# Altium schematic sheet Sheet1.SCHDOC
size 297 x 209 mm; SheetNumber: 1; SheetTotal: 1; DocumentName: Sheet1.SCHDOC
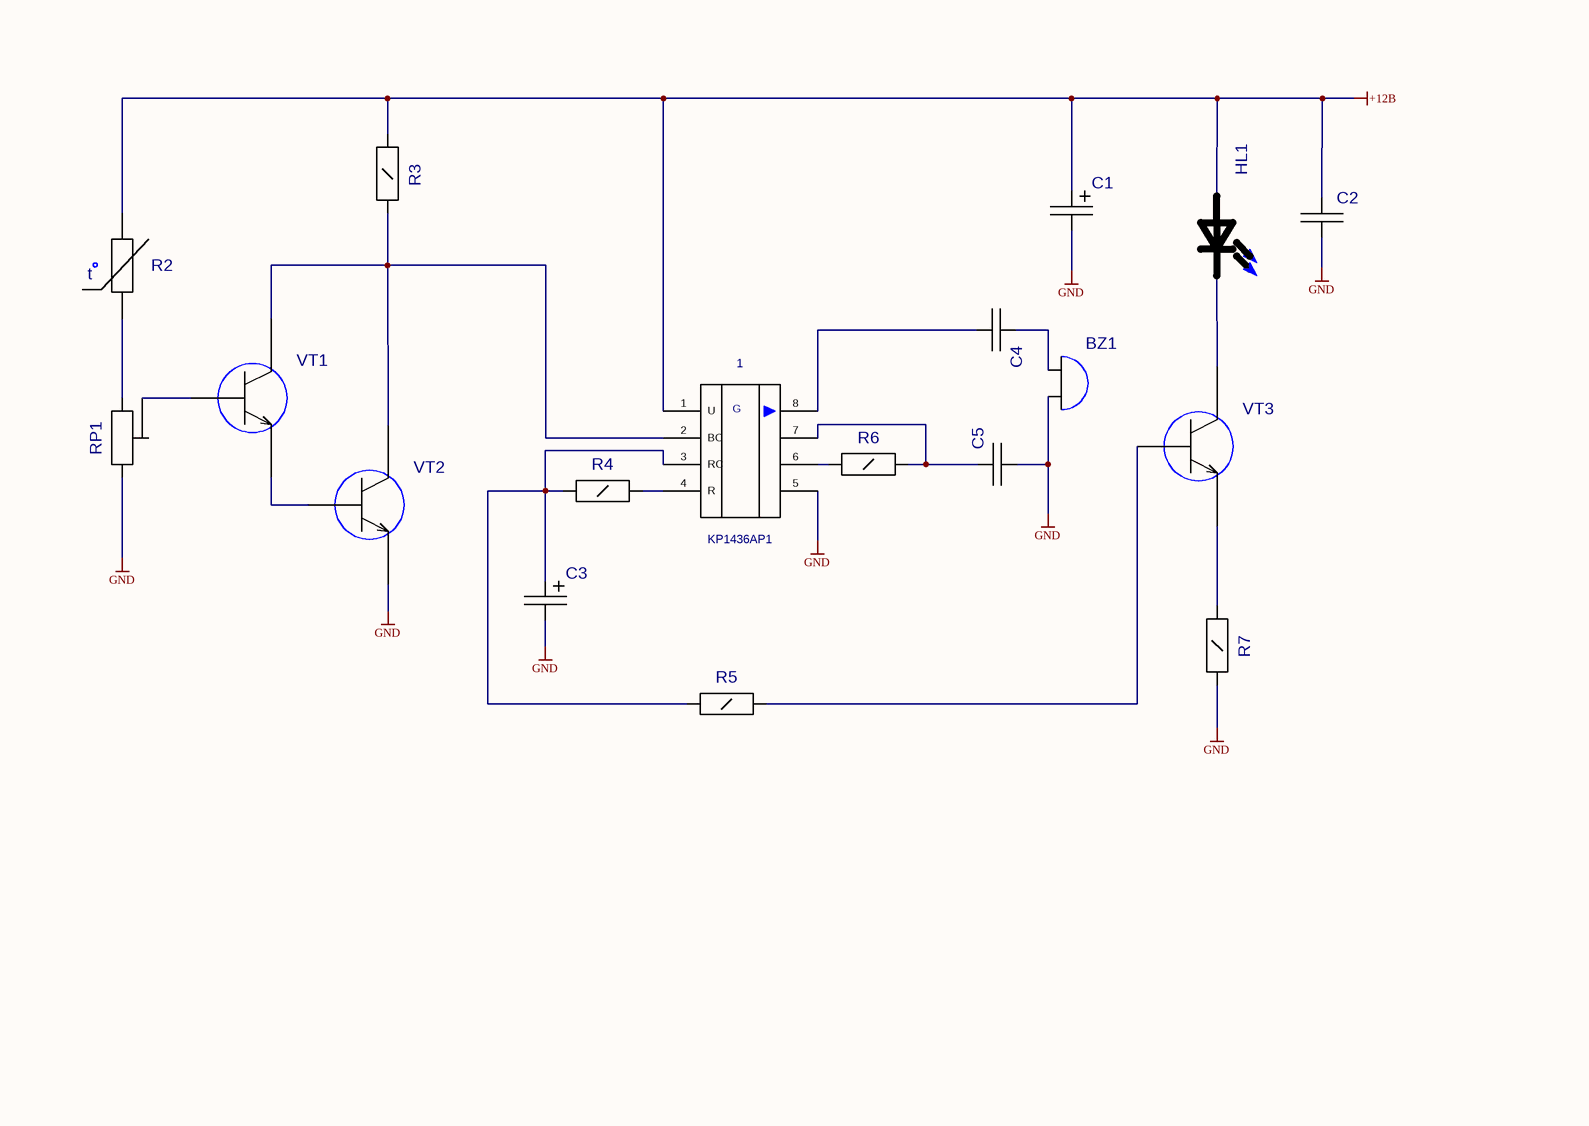
[diagram p0: Sheet1.SCHDOC]

## Parts
1  KP1436AP1  [KP1436AP1]
BZ1  ZUM1  [ZUM1]  (value not drawn)
C1  CE3528-B  [CE3528-B]  (value not drawn)
C2  CC0603  [CC0603]  (value not drawn)
C3  CE3528-B  [CE3528-B]  (value not drawn)
C4  CC0603  [CC0603]  (value not drawn)
C5  CC0603  [CC0603]  (value not drawn)
HL1  3528  [3528]  (value not drawn)
R2  B57861S0103F040  [B57861]  (value not drawn)
R3  C2-33H-0.25W_OLD_UGO  [C2-33H-0.25W]  (value not drawn)
R4  C2-33H-0.25W_OLD_UGO  [C2-33H-0.25W]  (value not drawn)
R5  C2-33H-0.25W_OLD_UGO  [C2-33H-0.25W]  (value not drawn)
R6  C2-33H-0.25W_OLD_UGO  [C2-33H-0.25W]  (value not drawn)
R7  C2-33H-0.25W_OLD_UGO  [C2-33H-0.25W]  (value not drawn)
RP1  3006W  [3006P]  (value not drawn)
VT1  2N4401  [TO-92-1]  (value not drawn)
VT2  2N4401  [TO-92-1]  (value not drawn)
VT3  2N4401  [TO-92-1]  (value not drawn)

## Nets
+12B: 1.1(U) C1.1(i/o) C2.2(i/o) HL1.A R2.2 R3.1
GND: 1.5 BZ1.2 C1.2(i/o1) C2.1(i/o1) C3.2(i/o1) C5.1(i/o1) R7.2 RP1.1 VT2.1(E)
Net1_2: 1.2(BC) R3.2 VT1.3(K) VT2.3(K)
Net1_3: 1.3(RC) C3.1(i/o) R4.1 R5.1
Net1_4: 1.4(R) R4.2
Net1_6: 1.6 R6.1
Net1_7: 1.7 C5.2(i/o) R6.2
Net1_8: 1.8 C4.1(i/o1)
NetBZ1_1: BZ1.1 C4.2(i/o)
NetHL1_K: HL1.K VT3.3(K)
NetR2_1: R2.1 RP1.3
NetR5_2: R5.2 VT3.2(B)
NetR7_1: R7.1 VT3.1(E)
NetRP1_2: RP1.2 VT1.2(B)
NetVT1_1: VT1.1(E) VT2.2(B)

## Notes on the sheet
- (in symbol B57861S0103F040) t
- (in symbol KP1436AP1) G

## Library data of the parts
R3-R7 = C2-33H-0.25W_OLD_UGO: Autor: pcbdesigner.ru; Value: *
1 = KP1436AP1: Value: *
BZ1 = ZUM1: Value: *
C1 C3 = CE3528-B: Value: *
C2 C4 C5 = CC0603: Value: *
R2 = B57861S0103F040: Value: *; Author: pcbdesigner.ru
RP1 = 3006W: Value: *
VT1-VT3 = 2N4401: Value: *